# EAGLE design base (EAGLE 6.5.0)
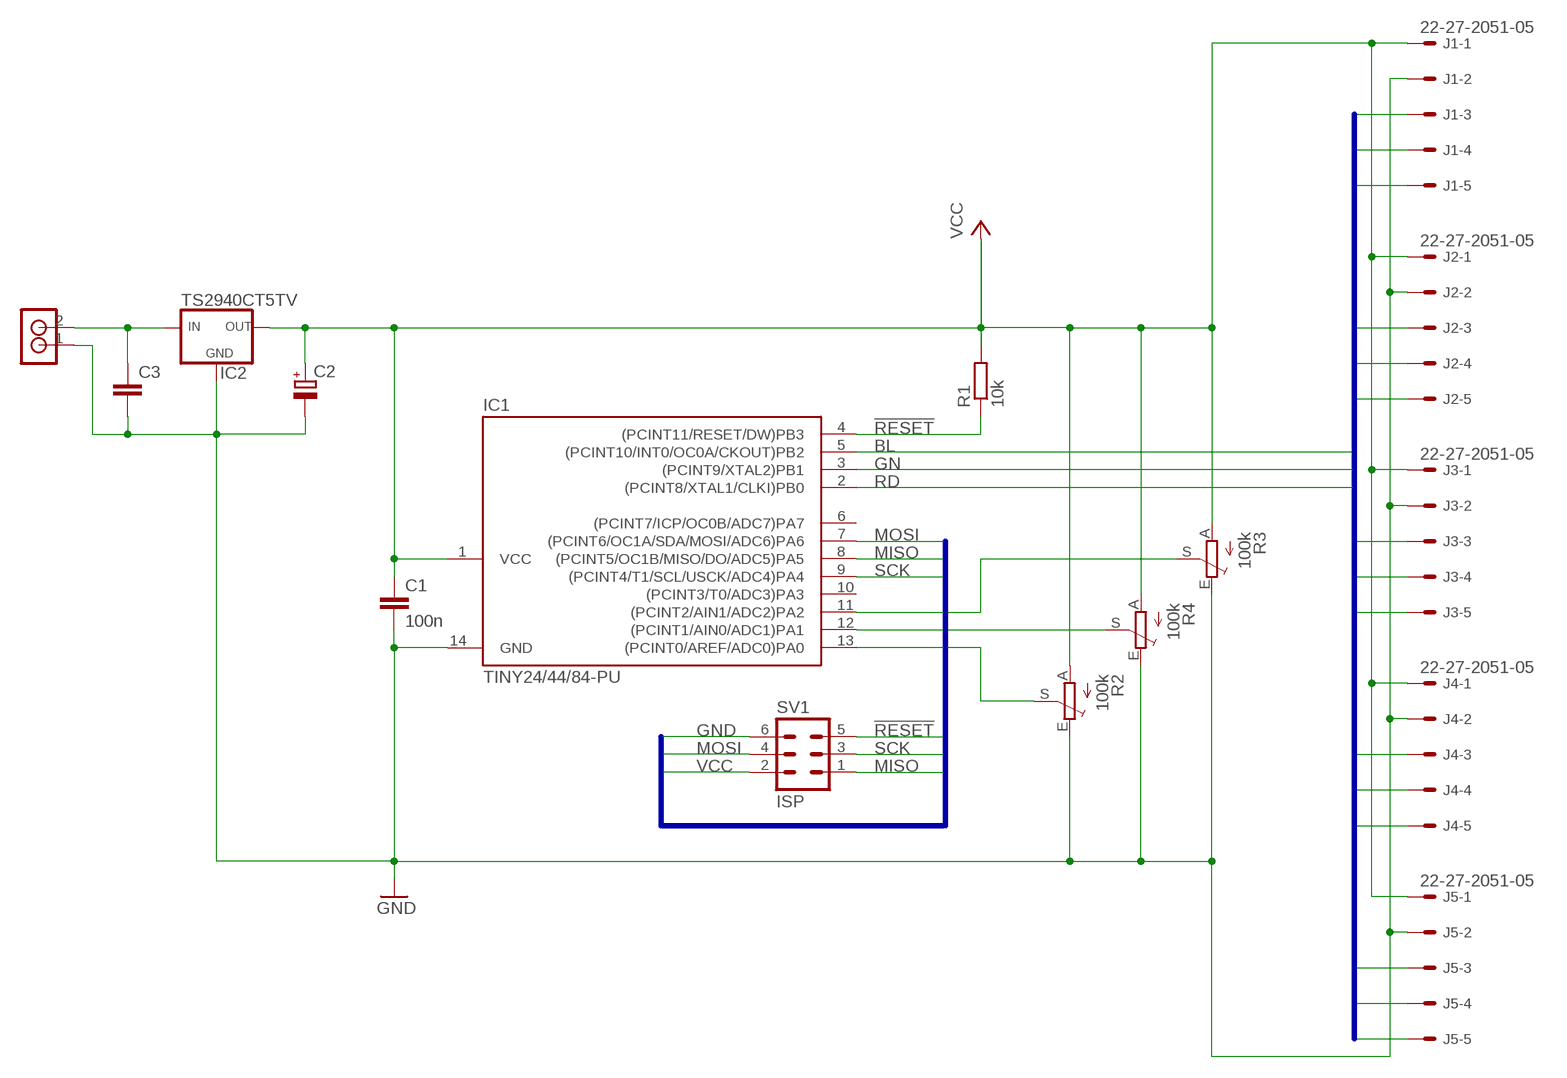
[diagram p0: schematic, sheet 1]

## Parts
C1  100n  C-EUC0805  [C0805]
C2  CPOL-EUE2.5-7  [E2,5-7]
C3  C-EU025-025X050  [C025-025X050]
IC1  TINY24/44/84-PU  [DIL14]
IC2  TS2940CT5TV  [TO220V]
J1  22-27-2051-05  [6410-05]
J2  22-27-2051-05  [6410-05]
J3  22-27-2051-05  [6410-05]
J4  22-27-2051-05  [6410-05]
J5  22-27-2051-05  [6410-05]
R1  10k  R-EU_R0805  [R0805]
R2  100k  TRIM_EU-CIP20C-6MM  [CIP20C-6MM]
R3  100k  TRIM_EU-CIP20C-6MM  [CIP20C-6MM]
R4  100k  TRIM_EU-CIP20C-6MM  [CIP20C-6MM]
SV1  ISP  ML6  [ML6]
U$9  RIACON_101_2  [RIACON_101_2]

## Nets
!RESET [signal]: IC1.4((PCINT11/RESET/DW)PB3) R1.1 SV1.5
BL [signal]: IC1.5((PCINT10/INT0/OC0A/CKOUT)PB2) J1.5 J2.5 J3.5 J4.5 J5.5
GN [signal]: IC1.3((PCINT9/XTAL2)PB1) J1.4 J2.4 J3.4 J4.4 J5.4
GND [supply]: C1.2 C2.- C3.2 IC1.14(GND) IC2.2(GND) J1.2 J2.2 J3.2 J4.2 J5.2 R2.E R3.E R4.E SV1.6 U$9.1
MISO [signal]: IC1.8((PCINT5/OC1B/MISO/DO/ADC5)PA5) SV1.1
MOSI [signal]: IC1.7((PCINT6/OC1A/SDA/MOSI/ADC6)PA6) SV1.4
N$1 [signal]: IC1.13((PCINT0/AREF/ADC0)PA0) R2.S
N$2 [signal]: IC1.12((PCINT1/AIN0/ADC1)PA1) R4.S
N$3 [signal]: IC1.11((PCINT2/AIN1/ADC2)PA2) R3.S
N$4: C3.1 IC2.1(IN) U$9.2
RD [signal]: IC1.2((PCINT8/XTAL1/CLKI)PB0) J1.3 J2.3 J3.3 J4.3 J5.3
SCK [signal]: IC1.9((PCINT4/T1/SCL/USCK/ADC4)PA4) SV1.3
VCC [supply]: C1.1 C2.+ IC1.1(VCC) IC2.3(OUT) J1.1 J2.1 J3.1 J4.1 J5.1 R1.2 R2.A R3.A R4.A SV1.2
Unconnected: IC1.6((PCINT7/ICP/OC0B/ADC7)PA7) IC1.10((PCINT3/T0/ADC3)PA3)

## Buses
ISP:MISO,MOSI,SCK,VCC,GND,!RESET
RGB:RD,GN,BL

## Library data of the parts
C1 C3 = rcl:C-EU: CAPACITOR, European symbol
C2 = rcl:CPOL-EU: POLARIZED CAPACITOR, European symbol
IC1 = avr-7:TINY24/44/84
IC2 = n39:TS2940: 1A Ultra Low Dropout Fixed Positive Voltage Regulator; REICHELT: LM 2940 CT5
J1-J5 = con-molex:22-?-05: CONNECTOR wire to board 2.54 mm (.1 inch) pitch header; OC_FARNELL: unknown; OC_NEWARK: unknown
R1 = rcl:R-EU_: RESISTOR, European symbol
R2-R4 = pot:TRIM_EU-: POTENTIOMETER
SV1 = con-ml:ML6: HARTING; OC_FARNELL: unknown; OC_NEWARK: unknown
U$9 = n39:RIACON_101_2: RIACON Anschlussklemme (AKL) Typ 101 Rastermaß 5,08 mm; REICHELT: AKL 101-02

## Net classes
1 supply: width 0.406 mm
2 signal: width 0.254 mm

## Board
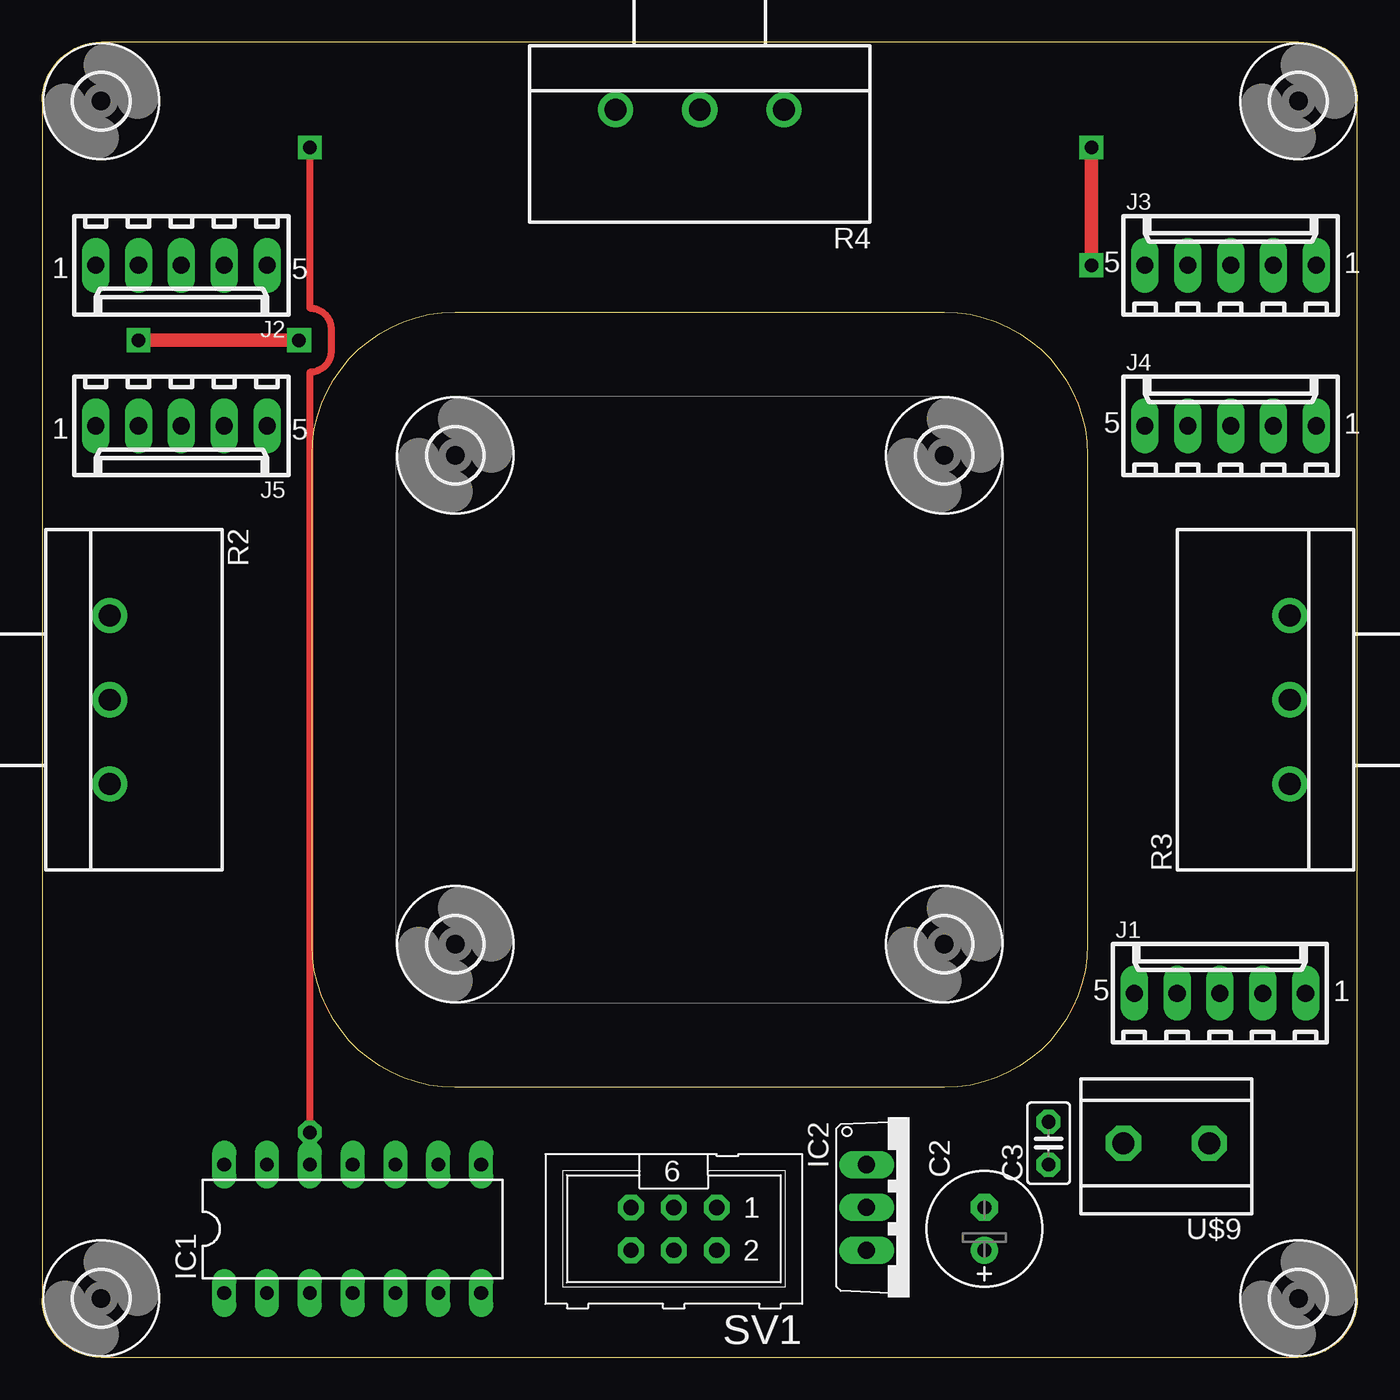
[diagram p1: board, top side]
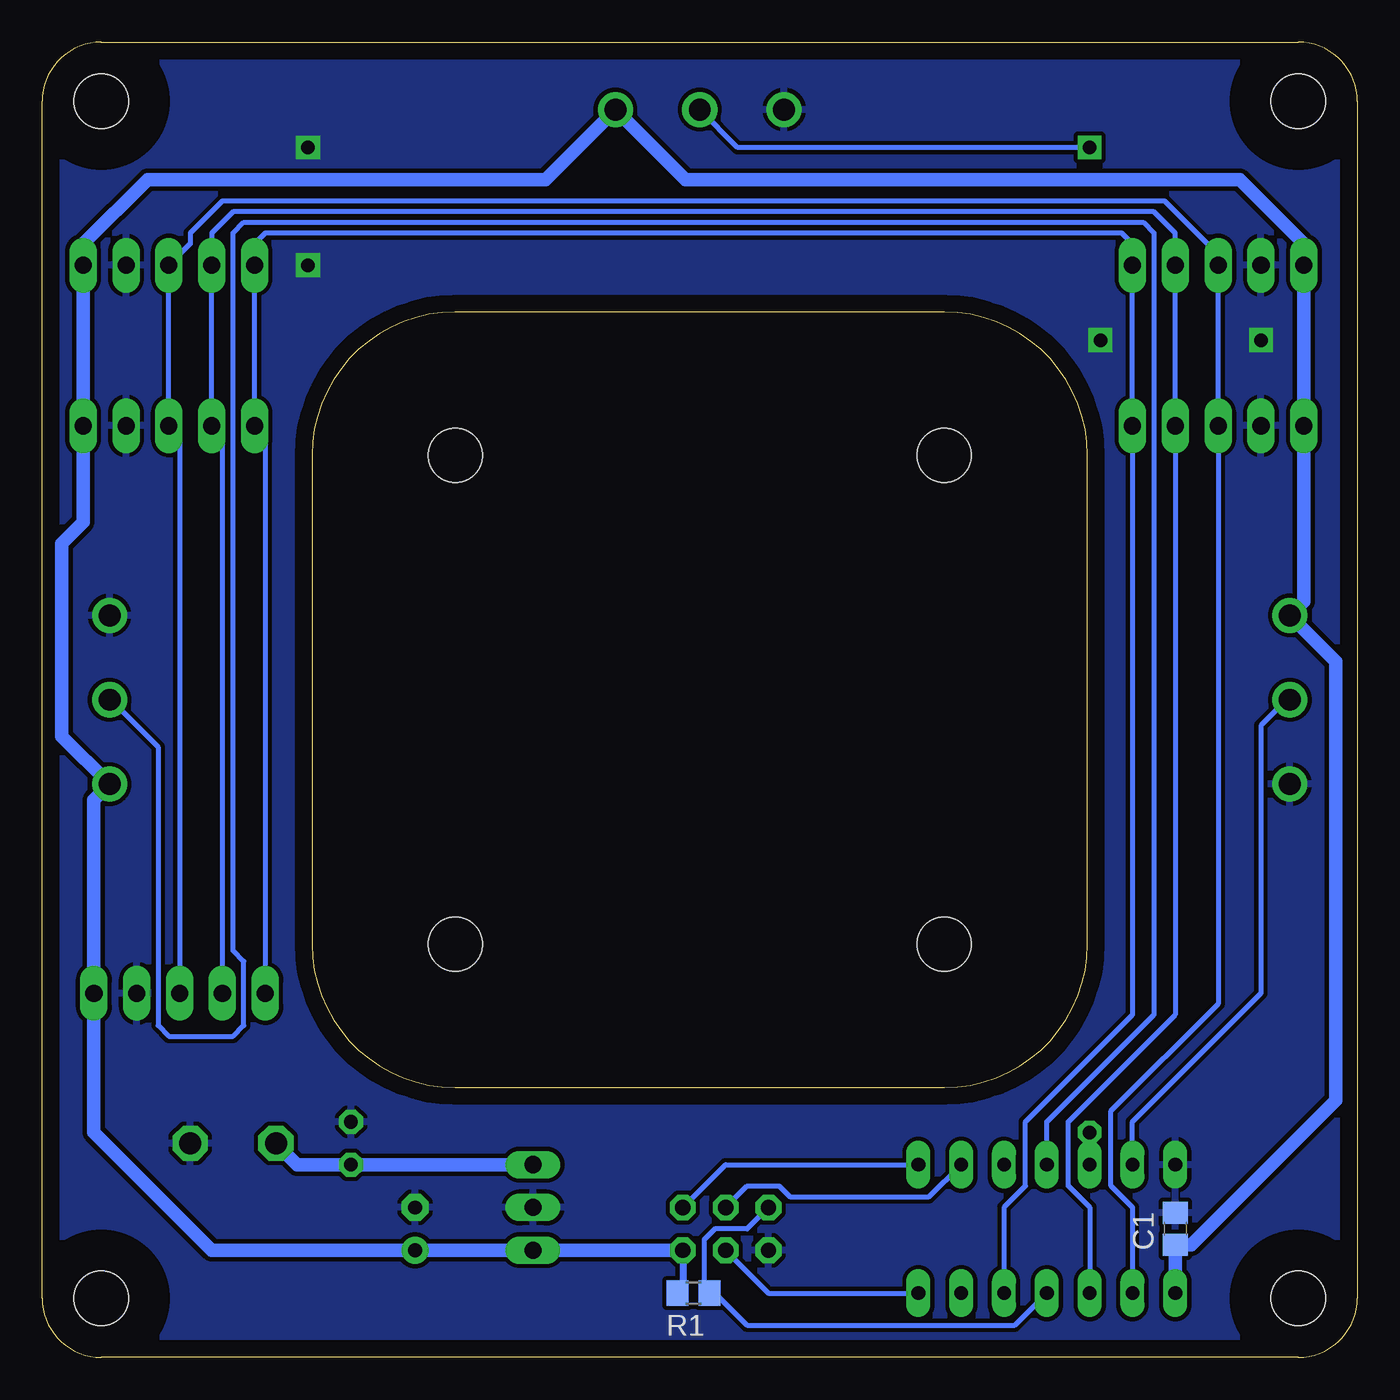
[diagram p2: board, bottom side, seen from below]

Size 78 x 78 mm. Coordinates in mm from the lower left corner, seen from the top.
Outline: 3.5,0 74.5,0 arc90 78,3.5 78,74.5 arc90 74.5,78 3.5,78 arc90 0,74.5 0,3.5 arc90 3.5,0
Outline: 24.5,62 53.5,62 arc-90 62,53.5 62,24.5 arc-90 53.5,16 24.5,16 arc-90 16,24.5 16,53.5 arc-90 24.5,62
Copper layers (1*16): Top 0.035mm / dielectric 1.5mm / Bottom 0.035mm
Design rules "default *": minimum track width 12mil, minimum drill 0.8mm, track to track 10mil, track to pad 10mil, pad to pad 10mil, via to via 10mil, smd to smd 8mil, copper to edge 40mil, drill to drill 12mil, minimum pad ring 12mil, minimum via ring 12mil, stop-mask expansion 4mil, vias tented up to drill 0mil, thermal gap 10mil

### Footprints (pad centres in the part's own frame; a part is rotated, then mirrored left to right if it is on the bottom)
C0805 = smd 1.3 x 1.5: 1 -0.95,0; 2 0.95,0
E2,5-7 = drill 0.813 pad 1.6: + -1.27,0 | drill 0.813 pad 1.6 octagon: - 1.27,0
C025-025X050 = drill 0.813 octagon: 1 -1.27,0; 2 1.27,0
DIL14 = drill 0.813 long: 1 -7.62,-3.81; 2 -5.08,-3.81; 3 -2.54,-3.81; 4 0,-3.81; 5 2.54,-3.81; 6 5.08,-3.81; 7 7.62,-3.81; 8 7.62,3.81; 9 5.08,3.81; 10 2.54,3.81; 11 0,3.81; 12 -2.54,3.81; 13 -5.08,3.81; 14 -7.62,3.81
TO220V = drill 1.016 long: 1 -2.54,-2.54; 2 0,-2.54; 3 2.54,-2.54
6410-05 = drill 1.016 long: 1 5.08,0; 2 2.54,0; 3 0,0; 4 -2.54,0; 5 -5.08,0
R0805 = smd 1.3 x 1.5: 1 -0.95,0; 2 0.95,0
CIP20C-6MM = drill 1.3 pad 1.93: A -5,0; E 5,0; S 0,0
ML6 = drill 0.914 octagon: 1 -2.54,-1.27; 2 -2.54,1.27; 3 0,-1.27; 4 0,1.27; 5 2.54,-1.27; 6 2.54,1.27
3,2 = hole 3.2: 0,0
RIACON_101_2 = drill 1.3 octagon: 1 -2.54,0; 2 2.54,0

### Placement (x,y rotation side)
C1  10.79,7.62 90 bottom
C2  55.88,7.62 90 top
C3  59.69,12.7 90 top
IC1  18.41,7.62 0 top
IC2  51.44,8.89 270 top
J1  69.85,21.59 0 top
J2  8.26,64.77 180 top
J3  70.48,64.77 0 top
J4  70.48,55.24 0 top
J5  8.26,55.24 180 top
R1  39.37,3.81 180 bottom
R2  4,39 270 top
R3  74,39 90 top
R4  39,74 180 top
SV1  37.47,7.62 180 top
U$1  [3,2]  3.5,74.5 0 top
U$2  [3,2]  74.5,74.5 0 top
U$3  [3,2]  3.5,3.5 0 top
U$4  [3,2]  74.5,3.5 0 top
U$5  [3,2]  24.5,53.5 0 top
U$6  [3,2]  24.5,24.5 0 top
U$7  [3,2]  53.5,24.5 0 top
U$8  [3,2]  53.5,53.5 0 top
U$9  66.67,12.7 180 top

### Tracks (layer width: path | path; a pad name or v marks a point on that pad's centre or on a via)
!RESET
  Bottom 0.305: SV1.5 36.2,7.62 38.1,7.62 38.73,6.99 38.73,3.81 R1.1 38.1,3.81 36.2,1.91 20.32,1.91 IC1.4
BL
  Bottom 0.305: J1.5 64.77,54.61 J4.5 J3.5 65.41,66.04 64.77,66.67 13.97,66.67 13.34,66.04 J2.5 J5.5 13.34,20.32 19.68,13.97 19.68,10.16 20.95,8.89 IC1.5
GN
  Bottom 0.305: J1.4 67.31,54.61 J4.4 J3.4 67.94,66.67 66.67,67.94 12.06,67.94 10.79,66.67 J2.4 J5.4 10.79,20.32 17.14,13.97 17.14,10.16 15.88,8.89 IC1.3
GND  (via drill 0.8)
  Top 0.813: v62.23,64.77 v62.23,71.75 | v5.71,60.33 v15.24,60.33
  pour Bottom: 45.5,78 74.5,78 arc-90 78,74.5 78,3.5 arc-90 74.5,0 3.5,0 arc-90 0,3.5 0,74.5 arc-90 3.5,78
MISO
  Bottom 0.305: IC1.8 37.47,11.43 SV1.1
MOSI
  Bottom 0.305: IC1.7 34.92,3.81 SV1.4
N$1
  Bottom 0.305: R2.S 4.45,38.73 5.71,37.47 5.71,21.59 13.34,13.97 IC1.13
N$2  (via drill 0.8)
  Top 0.406: v15.88,71.75 15.88,62.23 arc-90 17.14,60.96 17.14,59.69 arc-90 15.88,58.42 v15.88,13.34
  Bottom 0.305: IC1.12 v15.88,13.34 | v15.88,71.75 36.76,71.75 R4.S
N$3
  Bottom 0.305: R3.S 73.66,38.73 71.12,36.2 71.12,19.68 70.48,19.05 66.67,19.05 66.04,19.68 66.04,23.5 66.67,24.13 66.67,66.67 66.04,67.31 12.7,67.31 12.06,66.67 12.06,20.32 18.41,13.97 IC1.11
N$4
  Bottom 0.813: IC2.1 C3.1 62.87,11.43 U$9.2
RD
  Bottom 0.305: J1.3 69.85,54.61 J4.3 J3.3 69.22,66.04 69.22,66.67 67.31,68.58 11.43,68.58 8.26,65.41 J2.3 J5.3 8.26,20.95 14.61,14.61 14.61,10.16 13.34,8.89 IC1.2
SCK
  Bottom 0.305: IC1.9 25.4,9.53 33.66,9.53 34.29,10.16 36.2,10.16 SV1.3
VCC
  Bottom 0.406: SV1.2 40.01,4.12 R1.2
  Bottom 0.813: IC1.1 C1.1 9.84,6.67 1.27,15.24 1.27,41.27 R2.A 3.17,44.83 J5.1 J2.1 3.17,66.04 6.99,69.85 39.85,69.85 R4.A 48.15,69.85 71.75,69.85 75.56,66.04 J3.1 J4.1 75.56,49.53 76.83,48.26 76.83,36.84 R3.A 74.93,33.07 J1.1 74.93,13.34 67.94,6.35 C2.+ IC2.3 SV1.2